# Altium schematic sheet 04_4G通信模块与外围电路.SchDoc
size A4; DocumentNumber: 4; SheetNumber: 4; SheetTotal: 4
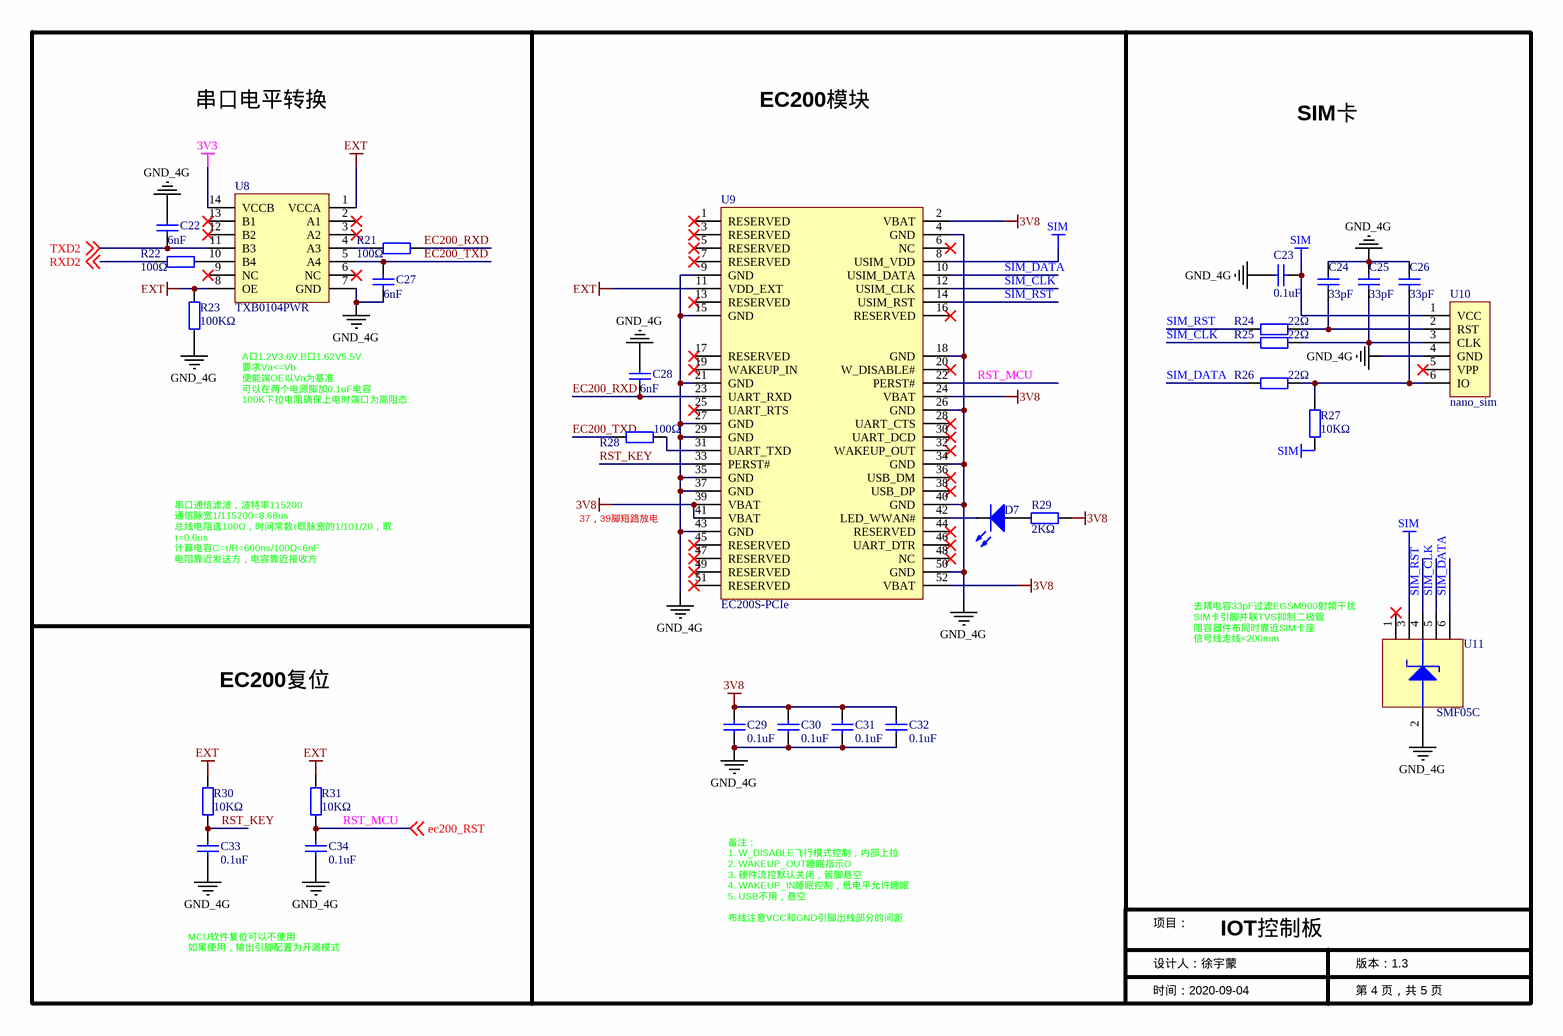
[diagram p0: 04_4G通信模块与外围电路.SchDoc]

## Parts
C22  value 6nF  [CAP-0603]  (hidden comment: Cap)
C23  value 0.1uF  [CAP-0603]  (hidden comment: Cap)
C24  value 33pF  [CAP-0603]  (hidden comment: Cap)
C25  value 33pF  [CAP-0603]  (hidden comment: Cap)
C26  value 33pF  [CAP-0603]  (hidden comment: Cap)
C27  value 6nF  [CAP-0603]  (hidden comment: Cap)
C28  value 6nF  [CAP-0603]  (hidden comment: Cap)
C29  value 0.1uF  [CAP-0603]  (hidden comment: Cap)
C30  value 0.1uF  [CAP-0603]  (hidden comment: Cap)
C31  value 0.1uF  [CAP-0603]  (hidden comment: Cap)
C32  value 0.1uF  [CAP-0603]  (hidden comment: Cap)
C33  value 0.1uF  [CAP-0603]  (hidden comment: Cap)
C34  value 0.1uF  [CAP-0603]  (hidden comment: Cap)
D7  LED  [LED_0805]  (value not drawn)
R21  value 100Ω  [0603]  (hidden comment: Res)
R22  value 100Ω  [0603]  (hidden comment: Res)
R23  value 100KΩ  [0603]  (hidden comment: Res)
R24  value 22Ω  [0603]  (hidden comment: Res)
R25  value 22Ω  [0603]  (hidden comment: Res)
R26  value 22Ω  [0603]  (hidden comment: Res)
R27  value 10KΩ  [0603]  (hidden comment: Res)
R28  value 100Ω  [0603]  (hidden comment: Res)
R29  value 2KΩ  [0603]  (hidden comment: Res)
R30  value 10KΩ  [0603]  (hidden comment: Res)
R31  value 10KΩ  [0603]  (hidden comment: Res)
U8  TXB0104PWR  [TSSOP-14]
U9  EC200S-PCIe  [miniPCIe1]
U10  nano_sim  [Nano_SIM_6P]
U11  SMF05C  [SOT-363]

## Nets
3V3: U8.14(VCCB)
3V8: C29.2 C30.2 C31.2 C32.2 R29.1 U9.2(VBAT) U9.24(VBAT) U9.39(VBAT) U9.41(VBAT) U9.52(VBAT)
EXT: R23.2 R30.2 R31.1 U8.1(VCCA) U8.8(OE) U9.11(VDD_EXT)
GND_4G: C22.1 C23.2 C24.1 C25.1 C26.2 C27.2 C28.1 C29.1 C30.1 C31.1 C32.1 C33.1 C34.2 R23.1 U8.7(GND) U9.4(GND) U9.9(GND) U9.15(GND) U9.18(GND) U9.21(GND) U9.26(GND) U9.27(GND) U9.29(GND) U9.34(GND) U9.35(GND) U9.37(GND) U9.40(GND) U9.43(GND) U9.50(GND) U10.4(GND) U11.2(gnd)
SIM: C23.1 R27.2 U9.8(USIM_VDD) U10.1(VCC) U11.3(gnd)
EC200_RXD: C28.2 R21.1 U9.23(UART_RXD)
EC200_TXD: C27.1 R28.2 U8.5(A4)
RST_KEY: C33.2 R30.1 U9.33(PERST#)
RST_MCU: C34.1 R31.2 U9.22(PERST#) ; off-sheet ec200_RST  [also labelled ec200_RST]
RXD2: R22.2 ; off-sheet RXD2
SIM_CLK: R25.1 U9.12(USIM_CLK) U11.5(gnd)
SIM_DATA: R26.1 U9.10(USIM_DATA) U11.6(gnd)
SIM_RST: R24.1 U9.14(USIM_RST) U11.4(gnd)
TXD2: C22.2 U8.11(B3) ; off-sheet TXD2
NetC24_2: C24.2 R24.2 U10.2(RST)
NetC25_2: C25.2 R25.2 U10.3(CLK)
NetC26_1: C26.1 R26.2 R27.1 U10.6(IO)
NetD7_1: D7.1(A) R29.2
NetD7_2: D7.2(K) U9.42(LED_WWAN#)
NetR21_2: R21.2 U8.4(A3)
NetR22_1: R22.1 U8.10(B4)
NetR28_1: R28.1 U9.31(UART_TXD)

Not connected (* = marked no-connect by the designer): U8 2(A1)* 3(A2)* 6(NC)* 9(NC)* 12(B2)* 13(B1)*; U9 1(RESERVED)* 3(RESERVED)* 5(RESERVED)* 6(NC)* 7(RESERVED)* 13(RESERVED)* 16(RESERVED)* 17(RESERVED)* 19(WAKEUP_IN)* 20(W_DISABLE#)* 25(UART_RTS)* 28(UART_CTS)* 30(UART_DCD)* 32(WAKEUP_OUT)* 36(USB_DM)* 38(USB_DP)* 44(RESERVED)* 45(RESERVED)* 46(UART_DTR)* 47(RESERVED)* 48(NC)* 49(RESERVED)* 51(RESERVED)*; U10 5(VPP)*; U11 1(gnd)*

## Notes on the sheet
- 串口电平转换
- EC200模块
- SIM卡
- A口1.2V3.6V,B口1.62V5.5V
  要求Va<=Vb
  使能端OE以Va为基准
  可以在两个电源脚加0.1uF电容
  100K下拉电阻确保上电时端口为高阻态
- 串口通信滤波，波特率115200
  通信脉宽1/115200=8.68us
  总线电阻选100Ω，时间常数τ取脉宽的1/101/20，取τ=0.6us
  计算电容C=τ/R=600ns/100Ω=6nF
  电阻靠近发送方，电容靠近接收方
- (near U9) 37，39脚短路放电
- EC200复位
- (near U11) 去耦电容33pF过滤EGSM900射频干扰
  SIM卡引脚并联TVS抑制二极管
  阻容器件布局时靠近SIM卡座
  信号线走线<200mm
- 项目：
- IOT控制板
- MCU软件复位可以不使用
  如果使用，输出引脚配置为开漏模式
- 备注：
  1. W_DISABLE飞行模式控制，内部上拉
  2. WAKEUP_OUT睡眠指示O
  3. 硬件流控默认关闭，管脚悬空
  4. WAKEUP_IN睡眠控制，低电平允许睡眠
  5. USB不用，悬空
  布线注意VCC和GND引脚出线部分的间距
- 设计人：徐宇蒙
- 时间：2020-09-04
- 第 4 页，共 5 页
- 版本：1.3

## Library data of the parts
C22-C34 = Cap: 无极性电容; Published: 8-Jun-2000; LatestRevisionDate: 17-Jul-2002; LatestRevisionNote: Re-released for DXP Platform.; PackageReference: RAD-0.3; Publisher: Altium Limited
D7 = LED: 发光二极管; Published: 8-Jun-2000; LatestRevisionDate: 08-Jul-2005; LatestRevisionNote: Mech Layer 1 removed.; PackageReference: LED-0; Publisher: Altium Limited
R21-R31 = Res: 贴片电阻; Published: 8-Jun-2000; LatestRevisionDate: 17-Jul-2002; LatestRevisionNote: Re-released for DXP Platform.; PackageReference: AXIAL-0.4; Publisher: Altium Limited
U8 = TXB0104PWR: 电平转换芯片
U9 = EC200T-PCIe